# Altium schematic sheet Supplies.SchDoc
size A; SheetNumber: 2; SheetTotal: 4
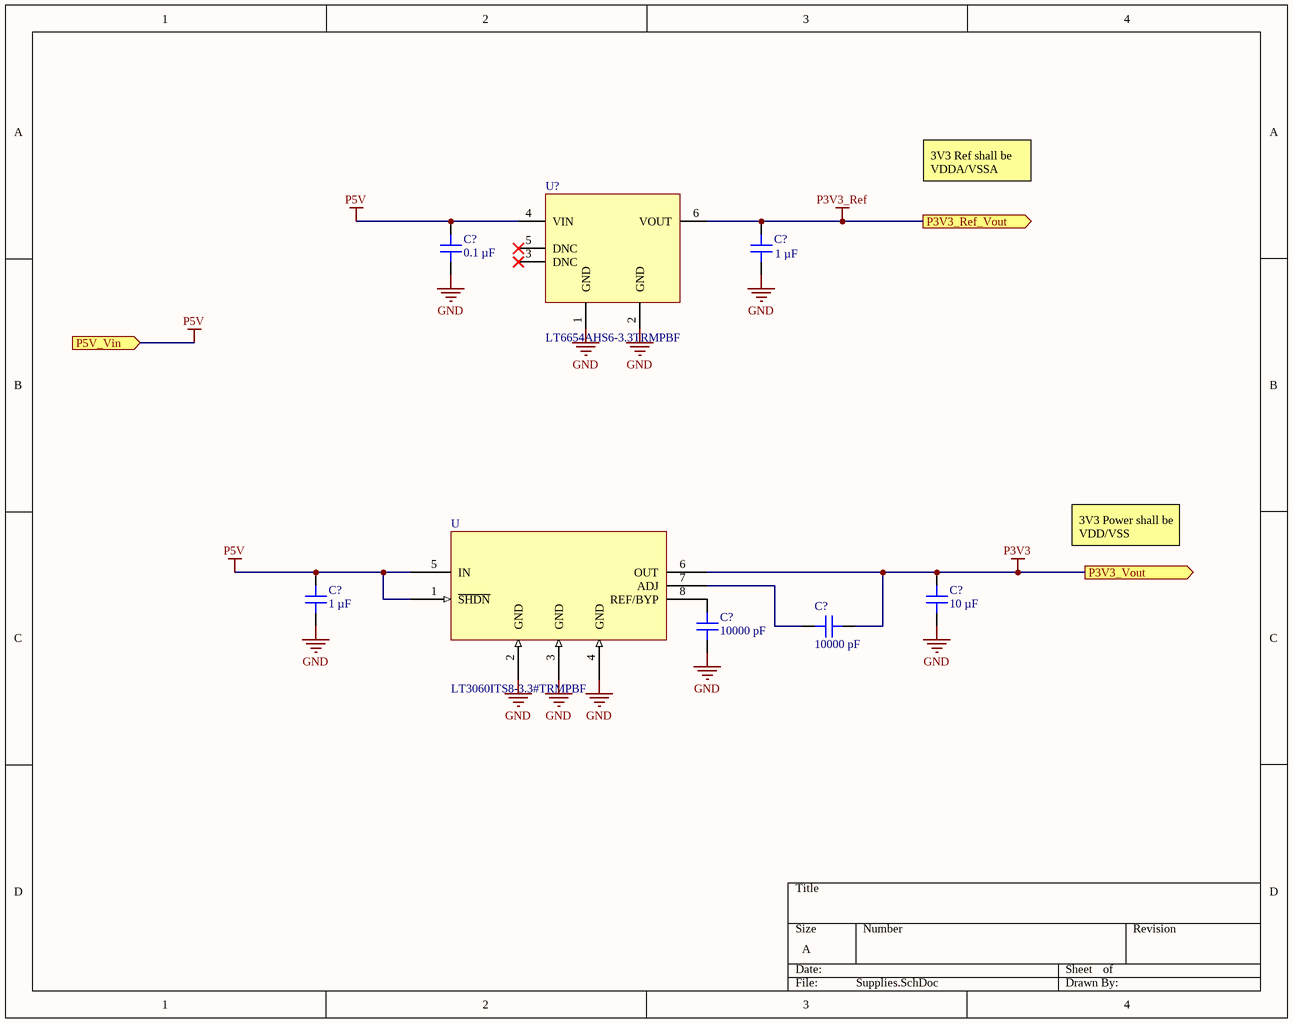
[diagram p0: Supplies.SchDoc]

## Parts
(Parts that share a designator on the sheet are numbered #1, #2 ... from top to bottom, then left to right.)
C?#1  0.1 µF  [CAP 0805_2012]
C?#2  1 µF  [CAP 0805_2012]
C?#3  1 µF  [CAP 0805_2012]
C?#4  10 µF  [CAP 1206_3216 - 0.8MM]
C?#5  10000 pF  [CAP 0805_2012]
C?#6  10000 pF  [CAP 0805_2012]
U  LT3060ITS8-3.3#TRMPBF  [TSOT-23_TS8]
U?  LT6654AHS6-3.3TRMPBF  [SOT95P280X100-6N]

## Ports
P3V3_Ref_Vout (out), P3V3_Vout (out), P5V_Vin (in)

## Nets
GND: C?#1.1 C?#2.1 C?#3.1 C?#4.1 C?#5.1 U.2(GND) U.3(GND) U.4(GND) U?.1(GND) U?.2(GND)
P3V3: C?#4.2 C?#6.1 U.6(OUT) ; port P3V3_Vout
P3V3_Ref: C?#2.2 U?.6(VOUT) ; port P3V3_Ref_Vout
P5V: C?#1.2 C?#3.2 U.1(~{SHDN}) U.5(IN) U?.4(VIN) ; port P5V_Vin
NetC?#5_2: C?#5.2 U.8(REF/BYP)
NetC?#6_2: C?#6.2 U.7(ADJ)

Not connected (* = marked no-connect by the designer): U? 3(DNC)* 5(DNC)*

## Notes on the sheet
- 3V3 Ref shall be VDDA/VSSA
- 3V3 Power shall be VDD/VSS

## Library data of the parts
C?#1 = C0805C104M3RAC7800: CAP CER 0.1UF 25V X7R 0805; manufacturer: KEMET; Tolerance: ±20%; Part Number: C0805C104M3RAC7800; Value: 0.1 µF; Applications: Bypass, Decoupling; Capacitance: 0.1 µF; componentlink1description: Datasheet; componentlink1url: https://api.kemet.com/component-edge/download/datasheet/C0805C104M3RACTU.pdf; componentlink2description: DigiKey Link; componentlink2url: https://www.digikey.com/en/products/detail/kemet/C0805C104M3RAC7800/2211748; Device Package: 0805 (2012 Metric); lastupdated: 8/21/2023 7:11:38 PM; Lifecycle Status: Active; Minimum Order: 1; Mounting Type: Surface Mount, MLCC; Operating Temperature: -55°C ~ 125°C; Package / Case: 0805 (2012 Metric); packaging: TapeAndReel; partid: 32959; Part Status: Active; price: 0.01; series: SMD Comm X7R; Size / Dimension: 0.079" L x 0.049" W (2.00mm x 1.25mm); Supplier 1: DigiKey; Supplier Part Number 1: 399-C0805C104M3RAC7800CT-ND; Temperature Coefficient: X7R; Thickness (Max): 0.035" (0.88mm); Voltage - Rated: 25V
C?#2 C?#3 = C0805C105M3RAC7800: CAP CER 1UF 25V X7R 0805; manufacturer: KEMET; Tolerance: ±20%; Part Number: C0805C105M3RAC7800; Value: 1 µF; Applications: Bypass, Decoupling; Capacitance: 1 µF; componentlink1description: Datasheet; componentlink1url: https://api.kemet.com/component-edge/download/datasheet/C0805C105M3RACTU.pdf; componentlink2description: DigiKey Link; componentlink2url: https://www.digikey.com/en/products/detail/kemet/C0805C105M3RAC7800/2211774; Device Package: 0805 (2012 Metric); lastupdated: 8/21/2023 7:11:38 PM; Lifecycle Status: Active; Minimum Order: 1; Mounting Type: Surface Mount, MLCC; Operating Temperature: -55°C ~ 125°C; Package / Case: 0805 (2012 Metric); packaging: TapeAndReel; partid: 32957; Part Status: Active; price: 0.02; series: SMD Comm X7R; Size / Dimension: 0.079" L x 0.049" W (2.00mm x 1.25mm); Supplier 1: DigiKey; Supplier Part Number 1: 399-C0805C105M3RAC7800CT-ND; Temperature Coefficient: X7R; Thickness (Max): 0.057" (1.45mm); Voltage - Rated: 25V
C?#4 = C1206C106M4RAC7800: CAP CER 10UF 16V X7R 1206; manufacturer: KEMET; Tolerance: ±20%; Part Number: C1206C106M4RAC7800; Value: 10 µF; Applications: Bypass, Decoupling; Capacitance: 10 µF; componentlink1description: Datasheet; componentlink1url: https://connect.kemet.com:7667/gateway/IntelliData-ComponentDocumentation/1.0/download/datasheet/C1206C106M4RACTU; componentlink2description: DigiKey Link; componentlink2url: https://www.digikey.com/en/products/detail/kemet/C1206C106M4RAC7800/1090844; Device Package: 1206 (3216 Metric); lastupdated: 8/21/2023 7:14:59 PM; Lifecycle Status: Active; Minimum Order: 1; Mounting Type: Surface Mount, MLCC; Operating Temperature: -55°C ~ 125°C; Package / Case: 1206 (3216 Metric); packaging: TapeAndReel; partid: 45390; Part Status: Active; price: 0.09; series: SMD Comm X7R; Size / Dimension: 0.126" L x 0.063" W (3.20mm x 1.60mm); Supplier 1: DigiKey; Supplier Part Number 1: 399-C1206C106M4RAC7800CT-ND; Temperature Coefficient: X7R; Thickness (Max): 0.071" (1.80mm); Voltage - Rated: 16V
C?#5 C?#6 = C0805C103M3RAC7800: CAP CER 10000PF 25V X7R 0805; manufacturer: KEMET; Tolerance: ±20%; Part Number: C0805C103M3RAC7800; Value: 10000 pF; Applications: Bypass, Decoupling; Capacitance: 10000 pF; componentlink1description: Datasheet; componentlink1url: https://api.kemet.com/component-edge/download/datasheet/C0805C103M3RACTU.pdf; componentlink2description: DigiKey Link; componentlink2url: https://www.digikey.com/en/products/detail/kemet/C0805C103M3RAC7800/2211730; Device Package: 0805 (2012 Metric); lastupdated: 8/21/2023 7:11:36 PM; Lifecycle Status: Active; Minimum Order: 1; Mounting Type: Surface Mount, MLCC; Operating Temperature: -55°C ~ 125°C; Package / Case: 0805 (2012 Metric); packaging: TapeAndReel; partid: 31983; Part Status: Active; price: 0.02; series: SMD Comm X7R; Size / Dimension: 0.079" L x 0.049" W (2.00mm x 1.25mm); Supplier 1: DigiKey; Supplier Part Number 1: 399-C0805C103M3RAC7800CT-ND; Temperature Coefficient: X7R; Thickness (Max): 0.035" (0.88mm); Voltage - Rated: 25V
U = LT3060ITS8-3.3#TRMPBF: LDO Regulator Pos 0.6V to 44.5V 0.1A Automotive 8-Pin TSOT-23 T/R; MP: LT3060HTS8#TRMPBF; MF: Analog Devices; Arrow_Electronics-Purchase-URL: https://snapeda.com/shop?store=Arrow+Electronics&id=4333210; Value: *; SnapEDA_Link: https://www.snapeda.com/parts/LT3060HTS8%23TRMPBF/Analog%20Devices/view-part/4333210/?ref=snap; Mouser-Purchase-URL: https://snapeda.com/shop?store=Mouser&id=4333210; Price: None; DigiKey-Purchase-URL: https://snapeda.com/shop?store=DigiKey&id=4333210; Package: SOT-23-8 Analog Devices; Availability: Unavailable
U? = LT6654AHS6-3.3TRMPBF: Precision Wide Supply High Output Drive Low Noise Reference; MF: Analog Devices; MP: LT6654AHS6-3.3#TRMPBF; SnapEDA_Link: https://www.snapeda.com/parts/LT6654AHS6-3.3%23TRMPBF/Analog+Devices/view-part/?ref=snap; Package: SOT-6 Analog Devices; Value: *; Check_prices: https://www.snapeda.com/parts/LT6654AHS6-3.3%23TRMPBF/Analog+Devices/view-part/?ref=eda